# Altium schematic sheet connect.SchDoc
size A3
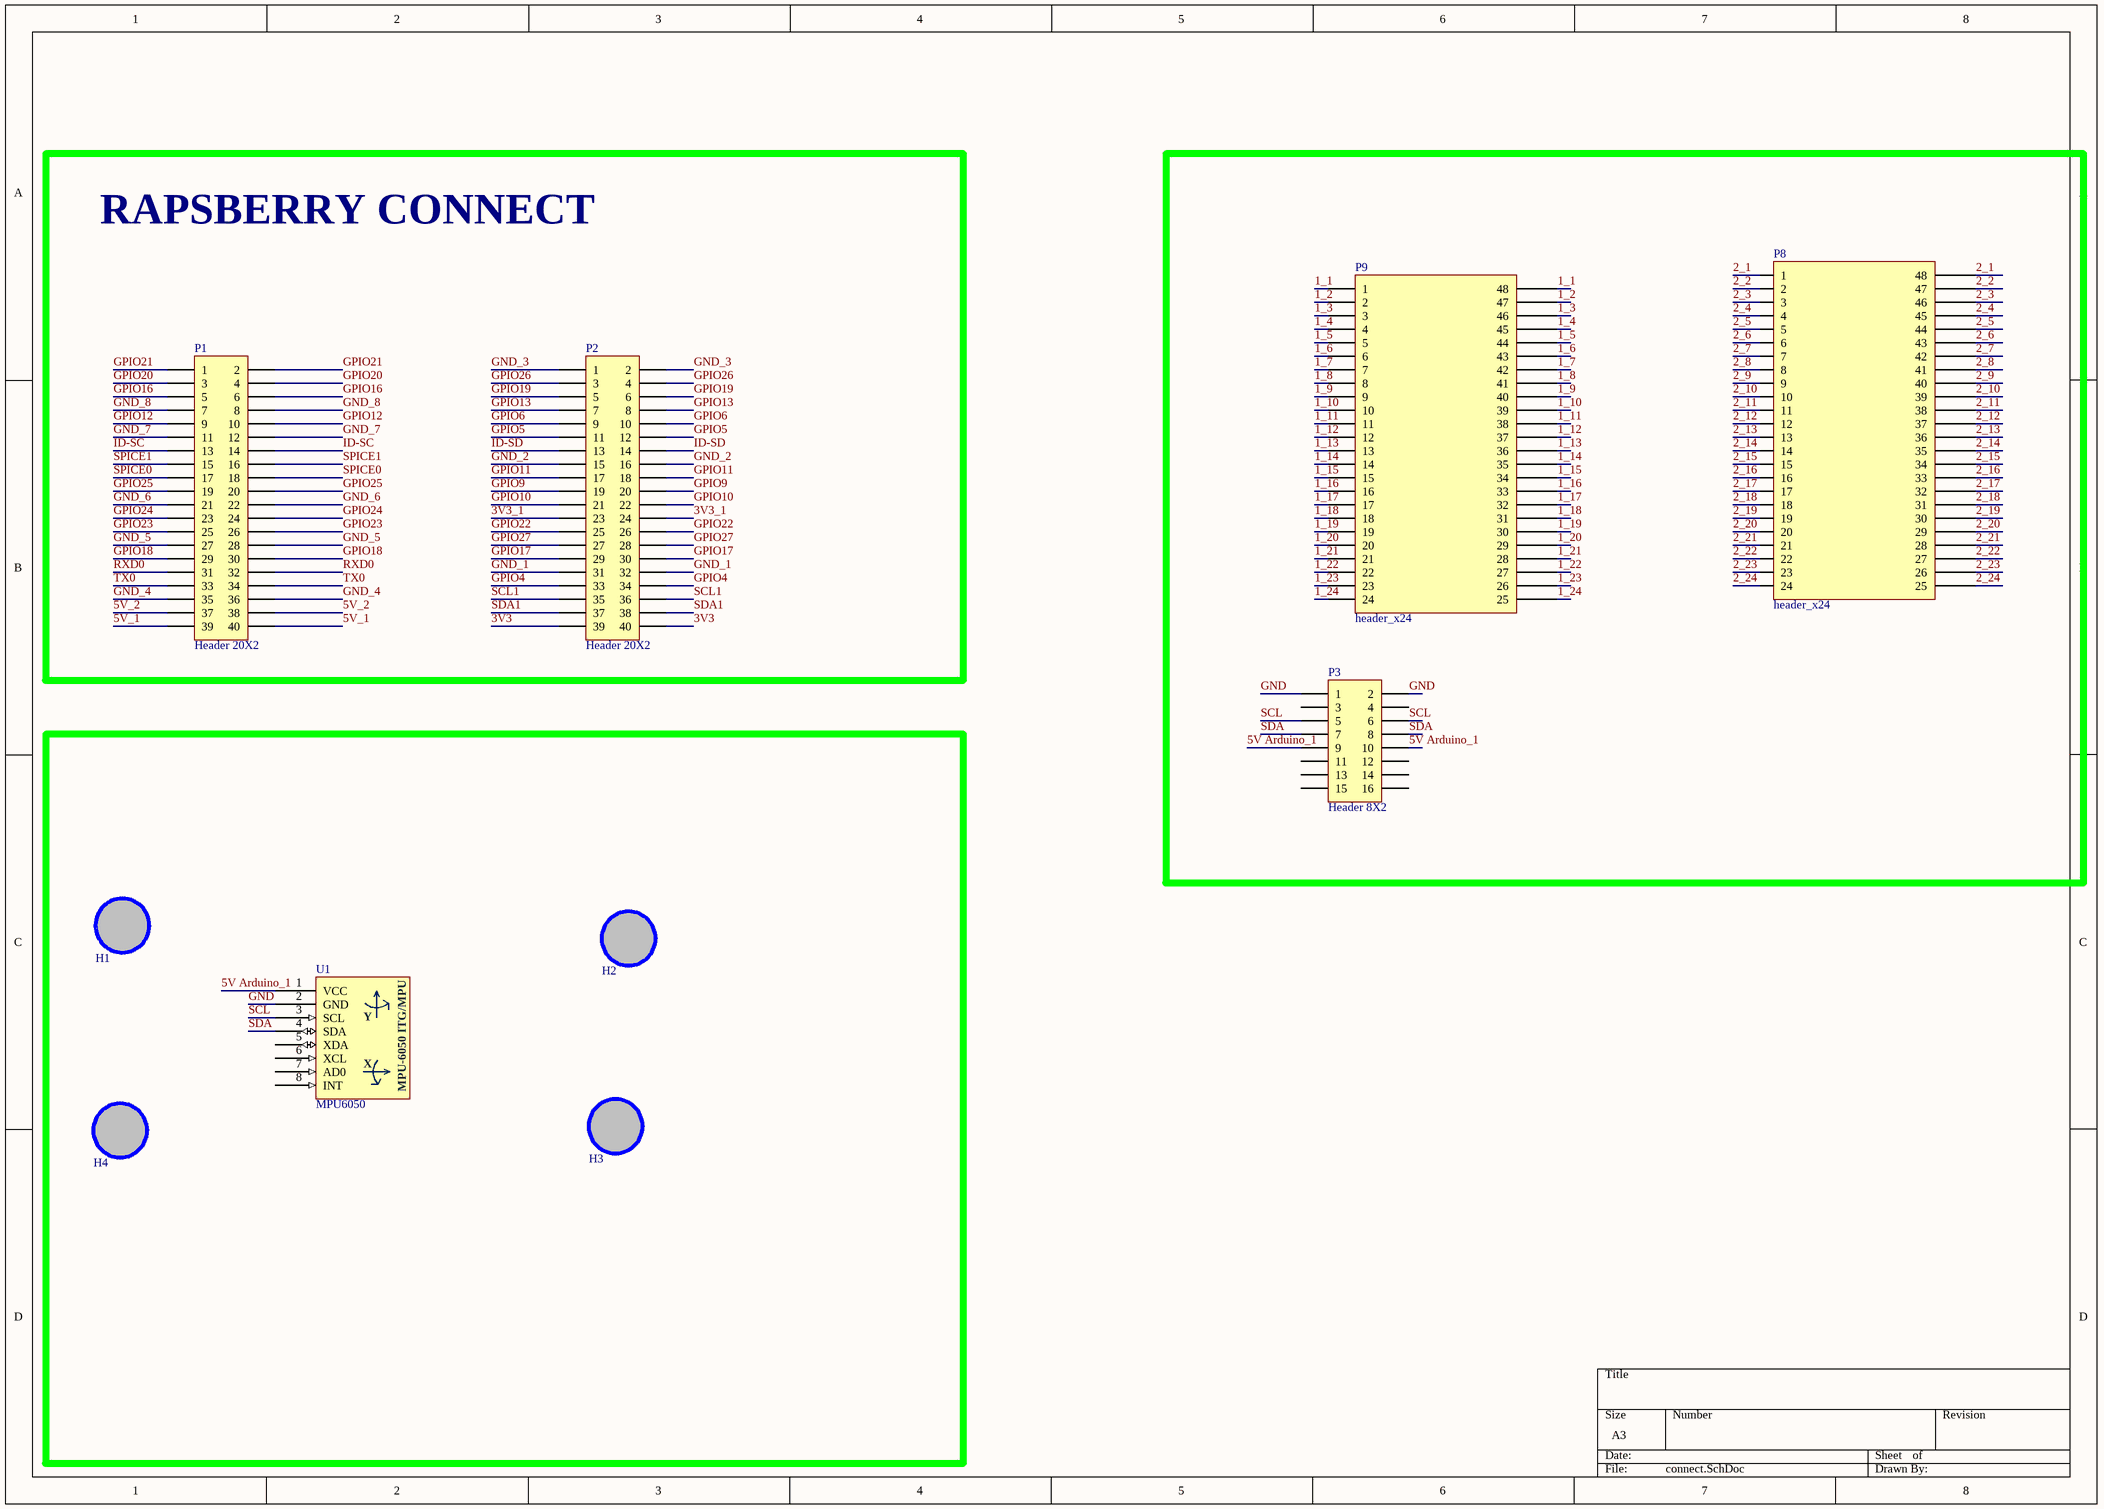
[diagram p0: connect.SchDoc]

## Parts
H1  Hole  [LO KHOAN 3MM]  (value not drawn)
H2  Hole  [LO KHOAN 3MM]  (value not drawn)
H3  Hole  [LO KHOAN 3MM]  (value not drawn)
H4  Hole  [LO KHOAN 3MM]  (value not drawn)
P1  Header 20X2  [MY_2X20]
P2  Header 20X2  [MY_2X20]
P3  Header 8X2  [HDR/Header/16/DL]
P8  header_x24  [header_x24]
P9  header_x24  [header_x24]
U1  MPU6050  [MPU-6050]

## Blocks framed on the sheet
RAPSBERRY CONNECT: P1 P2

## Nets
1_1: P9.1 P9.48
1_2: P9.2 P9.47
1_3: P9.3 P9.46
1_4: P9.4 P9.45
1_5: P9.5 P9.44
1_6: P9.6 P9.43
1_7: P9.7 P9.42
1_8: P9.8 P9.41
1_9: P9.9 P9.40
1_10: P9.10 P9.39
1_11: P9.11 P9.38
1_12: P9.12 P9.37
1_13: P9.13 P9.36
1_14: P9.14 P9.35
1_15: P9.15 P9.34
1_16: P9.16 P9.33
1_17: P9.17 P9.32
1_18: P9.18 P9.31
1_19: P9.19 P9.30
1_20: P9.20 P9.29
1_21: P9.21 P9.28
1_22: P9.22 P9.27
1_23: P9.23 P9.26
1_24: P9.24 P9.25
2_1: P8.1 P8.48
2_2: P8.2 P8.47
2_3: P8.3 P8.46
2_4: P8.4 P8.45
2_5: P8.5 P8.44
2_6: P8.6 P8.43
2_7: P8.7 P8.42
2_8: P8.8 P8.41
2_9: P8.9 P8.40
2_10: P8.10 P8.39
2_11: P8.11 P8.38
2_12: P8.12 P8.37
2_13: P8.13 P8.36
2_14: P8.14 P8.35
2_15: P8.15 P8.34
2_16: P8.16 P8.33
2_17: P8.17 P8.32
2_18: P8.18 P8.31
2_19: P8.19 P8.30
2_20: P8.20 P8.29
2_21: P8.21 P8.28
2_22: P8.22 P8.27
2_23: P8.23 P8.26
2_24: P8.24 P8.25
3V3: P2.39 P2.40
3V3_1: P2.23 P2.24
5V Arduino_1: P3.9 P3.10 U1.1(VCC)
5V_1: P1.39 P1.40
5V_2: P1.37 P1.38
GND: P3.1 P3.2 U1.2(GND)
GND_1: P2.31 P2.32
GND_2: P2.15 P2.16
GND_3: P2.1 P2.2
GND_4: P1.35 P1.36
GND_5: P1.27 P1.28
GND_6: P1.21 P1.22
GND_7: P1.11 P1.12
GND_8: P1.7 P1.8
GPIO4: P2.33 P2.34
GPIO5: P2.11 P2.12
GPIO6: P2.9 P2.10
GPIO9: P2.19 P2.20
GPIO10: P2.21 P2.22
GPIO11: P2.17 P2.18
GPIO12: P1.9 P1.10
GPIO13: P2.7 P2.8
GPIO16: P1.5 P1.6
GPIO17: P2.29 P2.30
GPIO18: P1.29 P1.30
GPIO19: P2.5 P2.6
GPIO20: P1.3 P1.4
GPIO21: P1.1 P1.2
GPIO22: P2.25 P2.26
GPIO23: P1.25 P1.26
GPIO24: P1.23 P1.24
GPIO25: P1.19 P1.20
GPIO26: P2.3 P2.4
GPIO27: P2.27 P2.28
ID-SC: P1.13 P1.14
ID-SD: P2.13 P2.14
RXD0: P1.31 P1.32
SCL: P3.5 P3.6 U1.3(SCL)
SCL1: P2.35 P2.36
SDA: P3.7 P3.8 U1.4(SDA)
SDA1: P2.37 P2.38
SPICE0: P1.17 P1.18
SPICE1: P1.15 P1.16
TX0: P1.33 P1.34

Not connected (* = marked no-connect by the designer): H1 1; H2 1; H3 1; H4 1; P3 3 4 11 12 13 14 15 16; U1 5(XDA) 6(XCL) 7(AD0) 8(INT)

## Notes on the sheet
- (in symbol MPU6050) Y; X; MPU-6050 ITG/MPU

## Library data of the parts
H1-H4 = Hole: Hole 3mm
P1 P2 = Header 20X2: Header, 40-Pin, Dual row; ASiD Part Number: Header 20X2-AS
P3 = Header 8X2: Header, 8-Pin, Dual row
U1 = MPU6050: The MPU-6050™ parts are the world’s first MotionTracking devices designed for the low power, low cost, and high-performance requirements of smartphones, tablets and wearable sensors.; Mfr: DFRobot; Sensing Range: ±2g, 4g, 8g, 16g, ±250°/sec, ±500°/sec, ±1000°/sec, ±2000°/sec; Sensor Type: Accelerometer, Gyroscope, 3 Axis; Interface: I2C; Voltage - Supply: 3V ~ 5V; Category: Development Boards, Kits, Programmers; Utilized IC / Part: MPU-6050; ComponentLink1Description: Hshop; ComponentLink1URL: https://hshop.vn/products/cam-bien-6-dof-bac-tu-do-gy-521-mpu6050